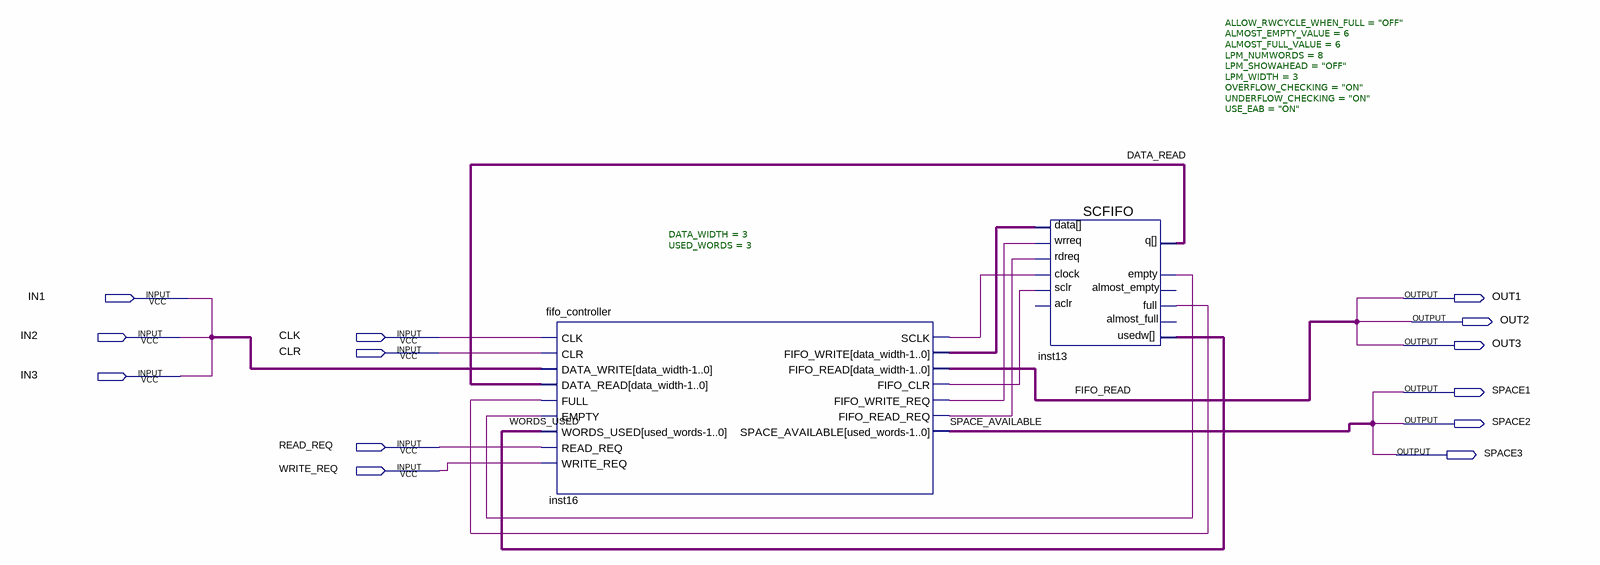
[diagram p0: schematic sheet]
// Quartus schematic test.bdf as structural Verilog: 2 symbols, 13 pins
module test (
  input  IN1,
  input  IN2,
  input  CLK,
  input  CLR,
  input  IN3,
  input  READ_REQ,
  input  WRITE_REQ,
  output OUT1,
  output OUT2,
  output OUT3,
  output SPACE1,
  output SPACE2,
  output SPACE3
);

  wire DATA_READ, FIFO_READ, inst13_empty, inst13_full, inst16_fifo_clr, inst16_fifo_read_req,
       inst16_fifo_write_req, inst16_sclk, SPACE_AVAILABLE, WORDS_USED;
  wire [2:0] inst16_fifo_write, undriven;

  fifo_controller #(.DATA_WIDTH(3), .USED_WORDS(3)) inst16 (
    .CLK(CLK), .CLR(CLR), .DATA_WRITE(undriven), .DATA_READ({3{DATA_READ}}), .FULL(inst13_full),
    .EMPTY(inst13_empty), .WORDS_USED({3{WORDS_USED}}), .READ_REQ(READ_REQ), .WRITE_REQ(WRITE_REQ),
    .SCLK(inst16_sclk), .FIFO_WRITE(inst16_fifo_write), .FIFO_READ(FIFO_READ), .FIFO_CLR(inst16_fifo_clr),
    .FIFO_WRITE_REQ(inst16_fifo_write_req), .FIFO_READ_REQ(inst16_fifo_read_req),
    .SPACE_AVAILABLE(SPACE_AVAILABLE));
  SCFIFO #(.ALLOW_RWCYCLE_WHEN_FULL("OFF"), .ALMOST_EMPTY_VALUE(6), .ALMOST_FULL_VALUE(6), .LPM_NUMWORDS(8), .LPM_SHOWAHEAD("OFF"), .LPM_WIDTH(3), .OVERFLOW_CHECKING("ON"), .UNDERFLOW_CHECKING("ON"), .USE_EAB("ON")) inst13 (
    .clock(inst16_sclk), .data(inst16_fifo_write), .wrreq(inst16_fifo_write_req),
    .rdreq(inst16_fifo_read_req), .sclr(inst16_fifo_clr), .q(DATA_READ), .empty(inst13_empty),
    .full(inst13_full), .usedw(WORDS_USED));  // open: aclr, almost_empty, almost_full
endmodule
